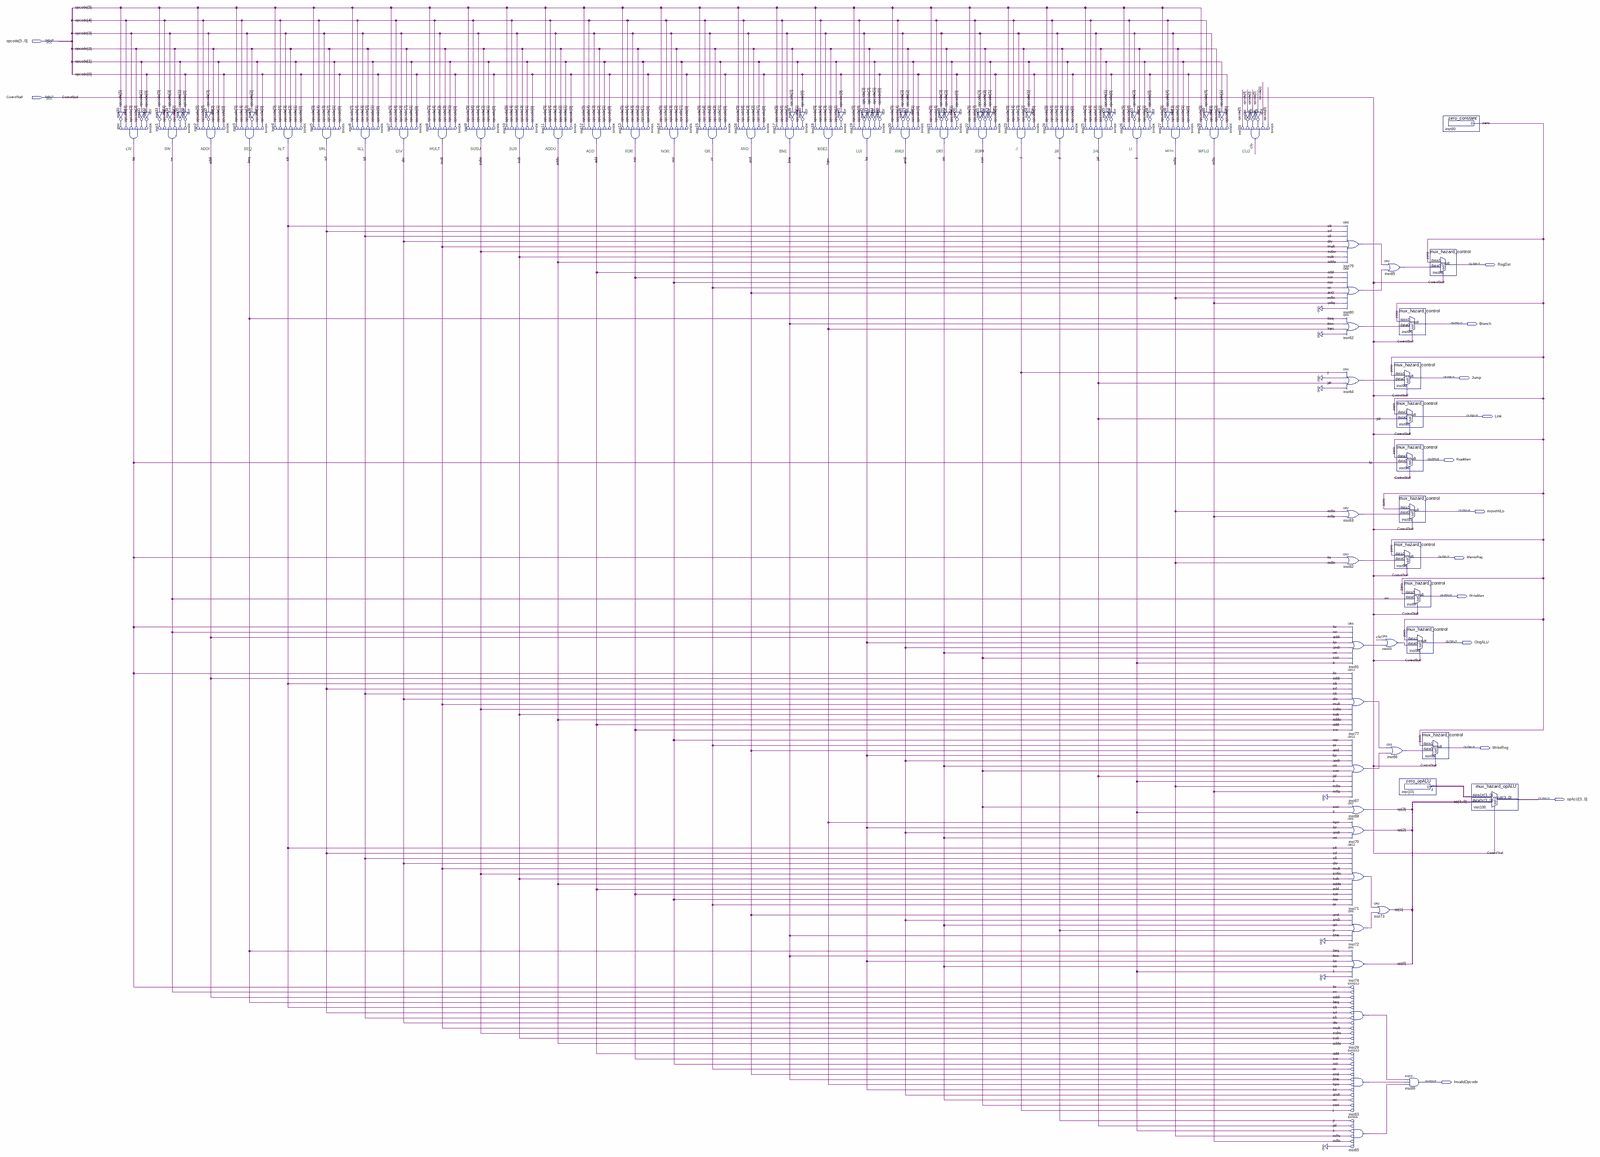
[diagram p0: schematic sheet, whole]
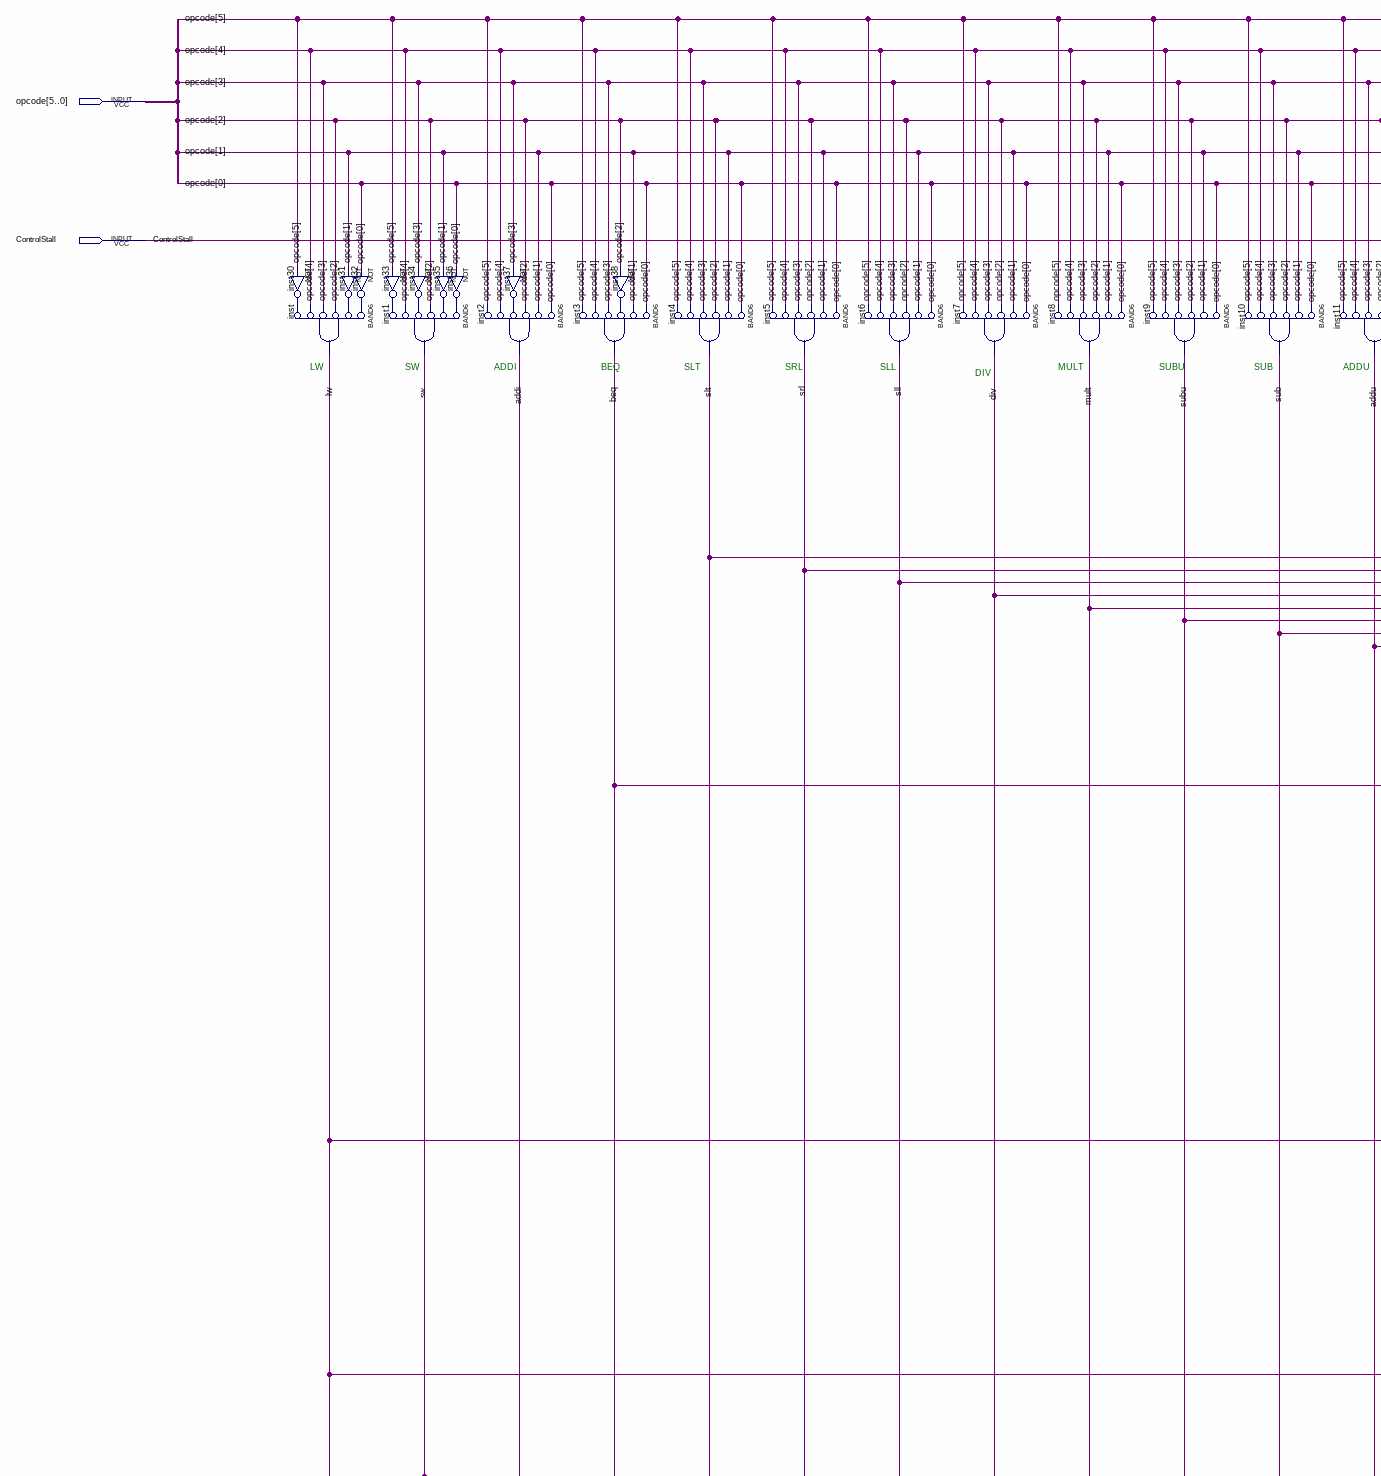
[diagram p1: schematic sheet, upper left part]
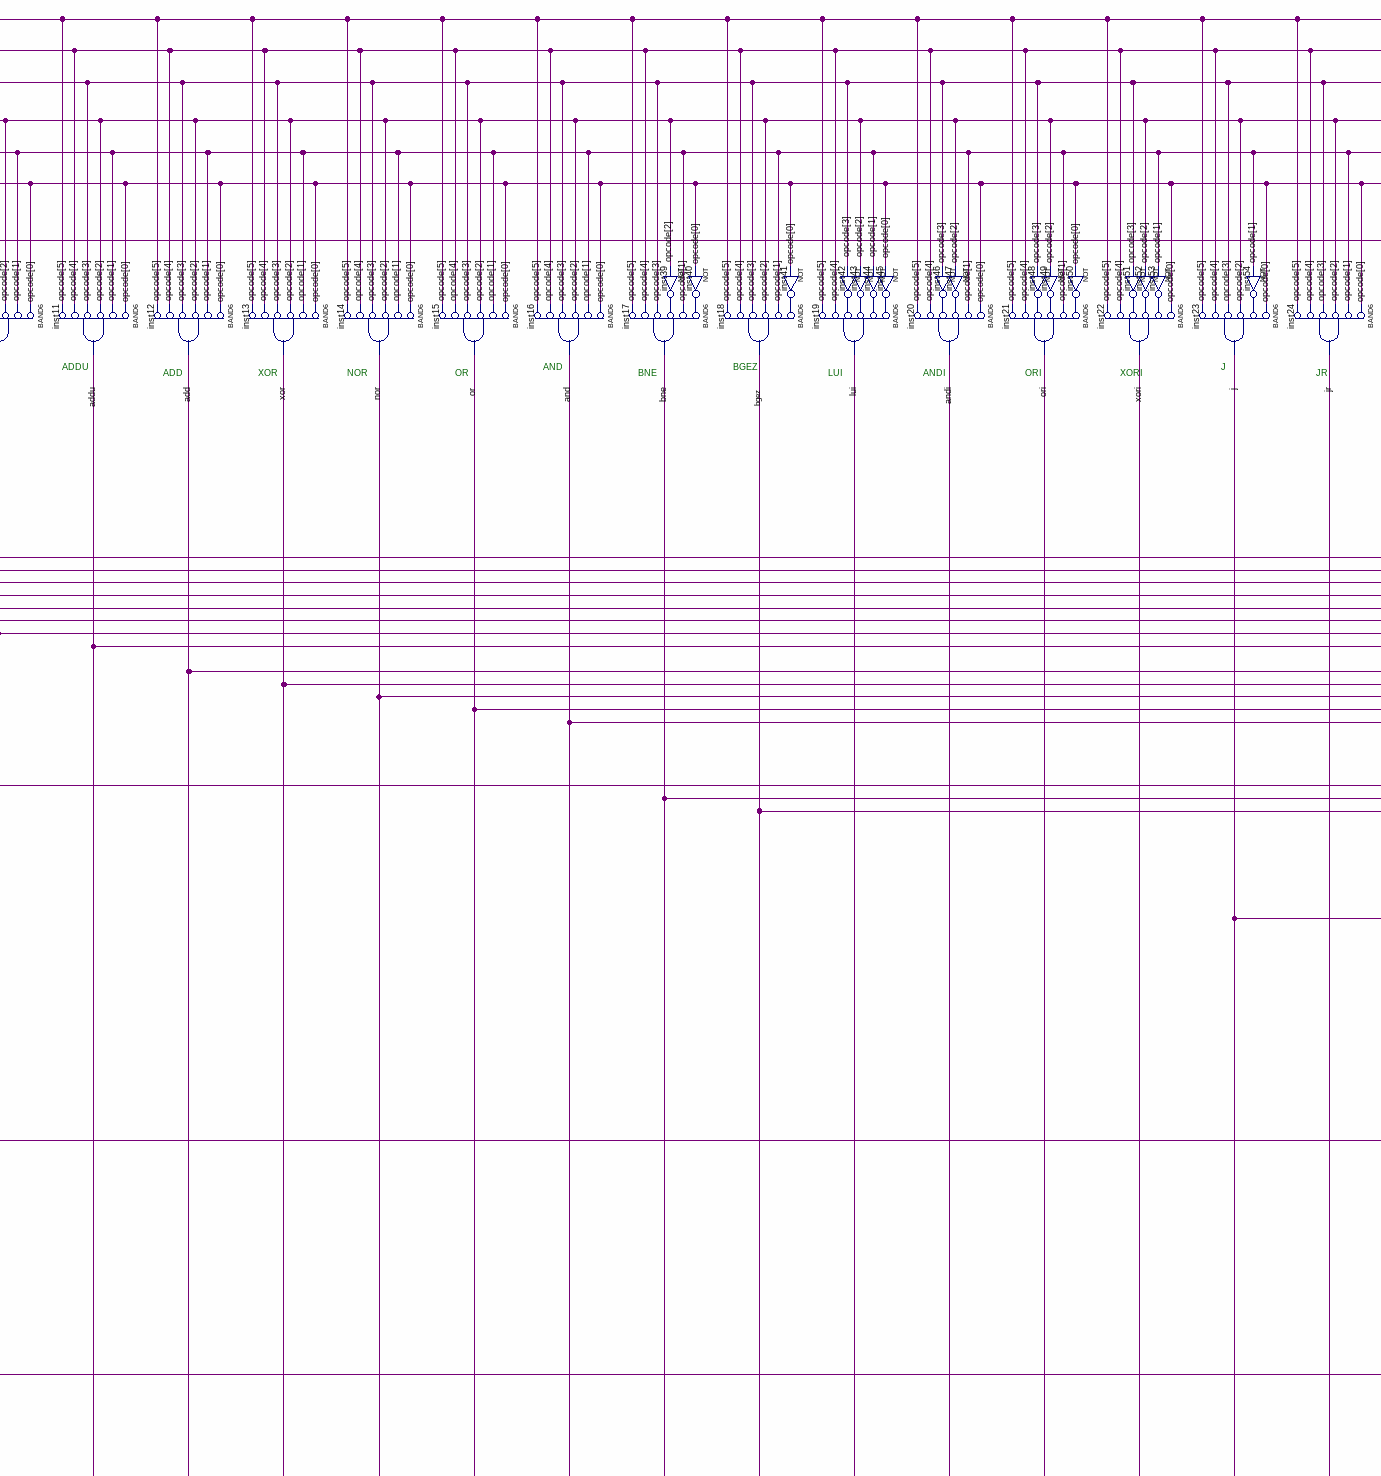
[diagram p2: schematic sheet, upper centre part]
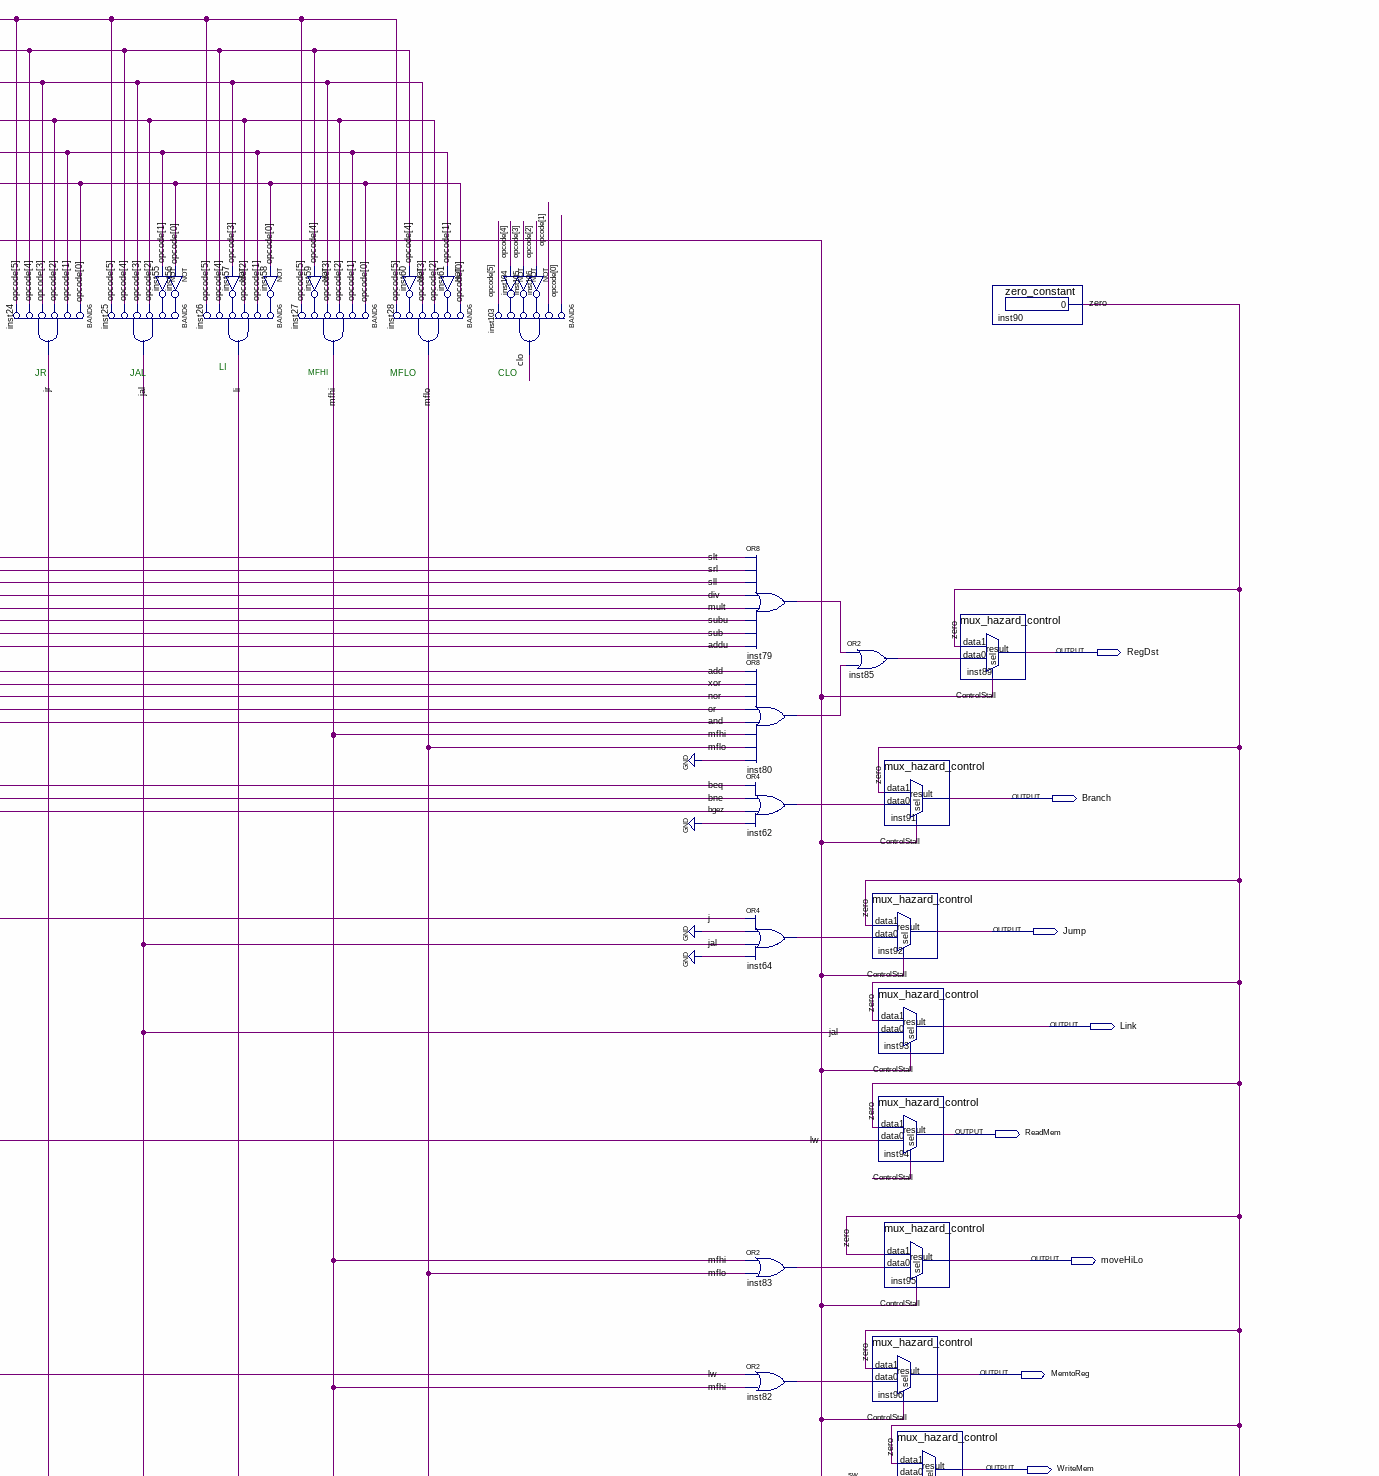
[diagram p3: schematic sheet, upper right part]
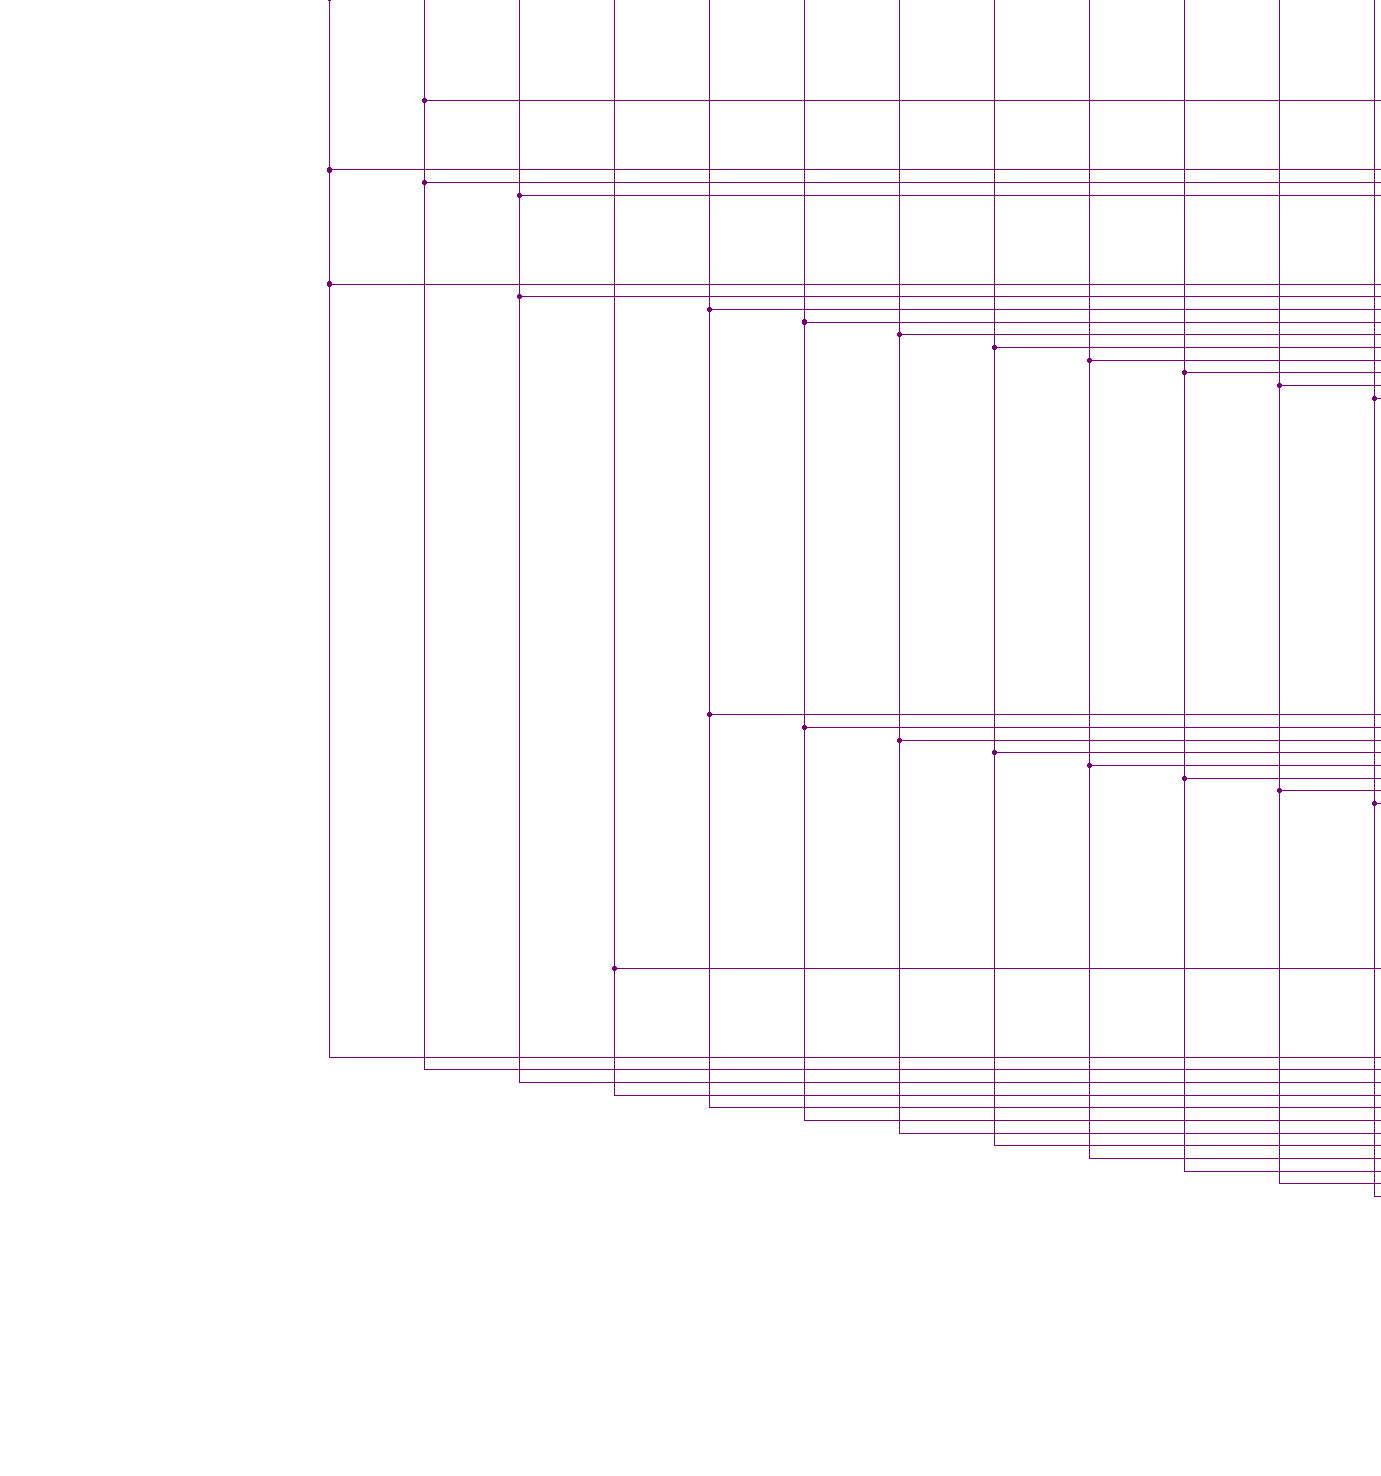
[diagram p4: schematic sheet, lower left part]
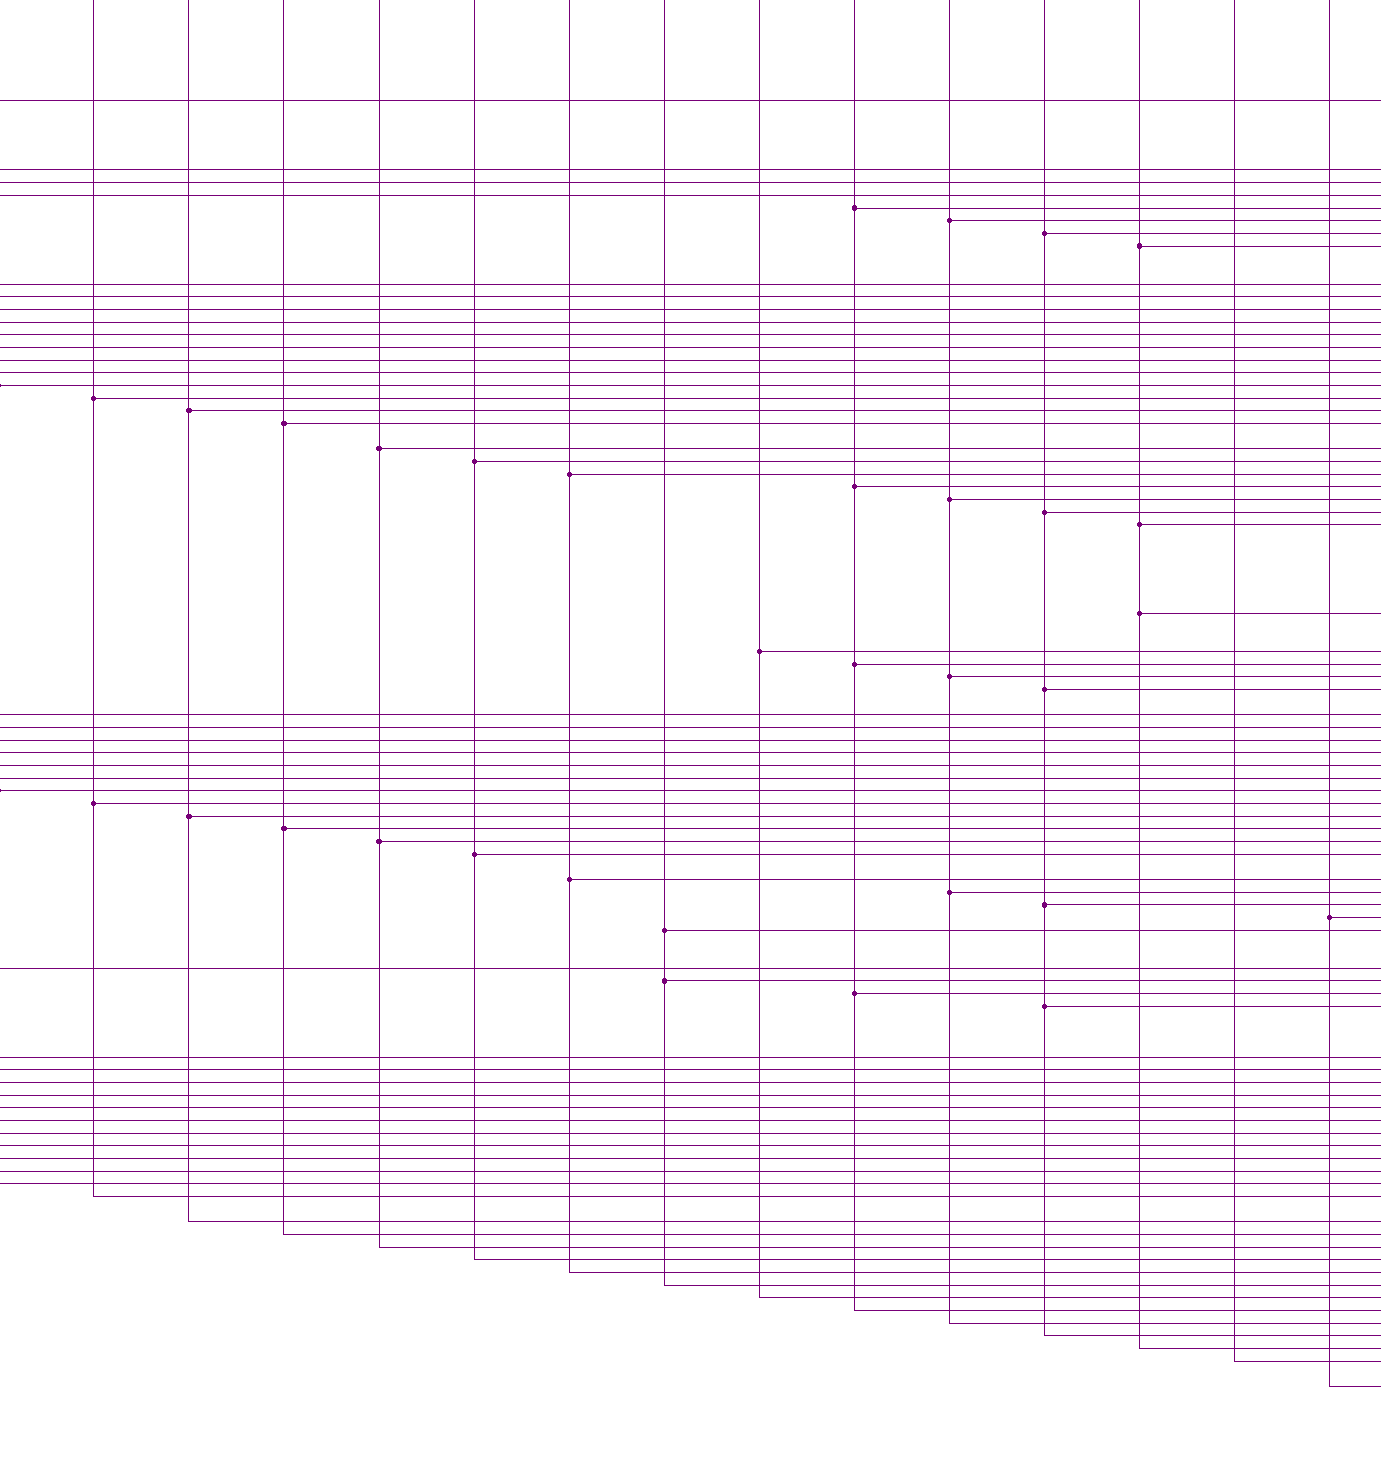
[diagram p5: schematic sheet, lower centre part]
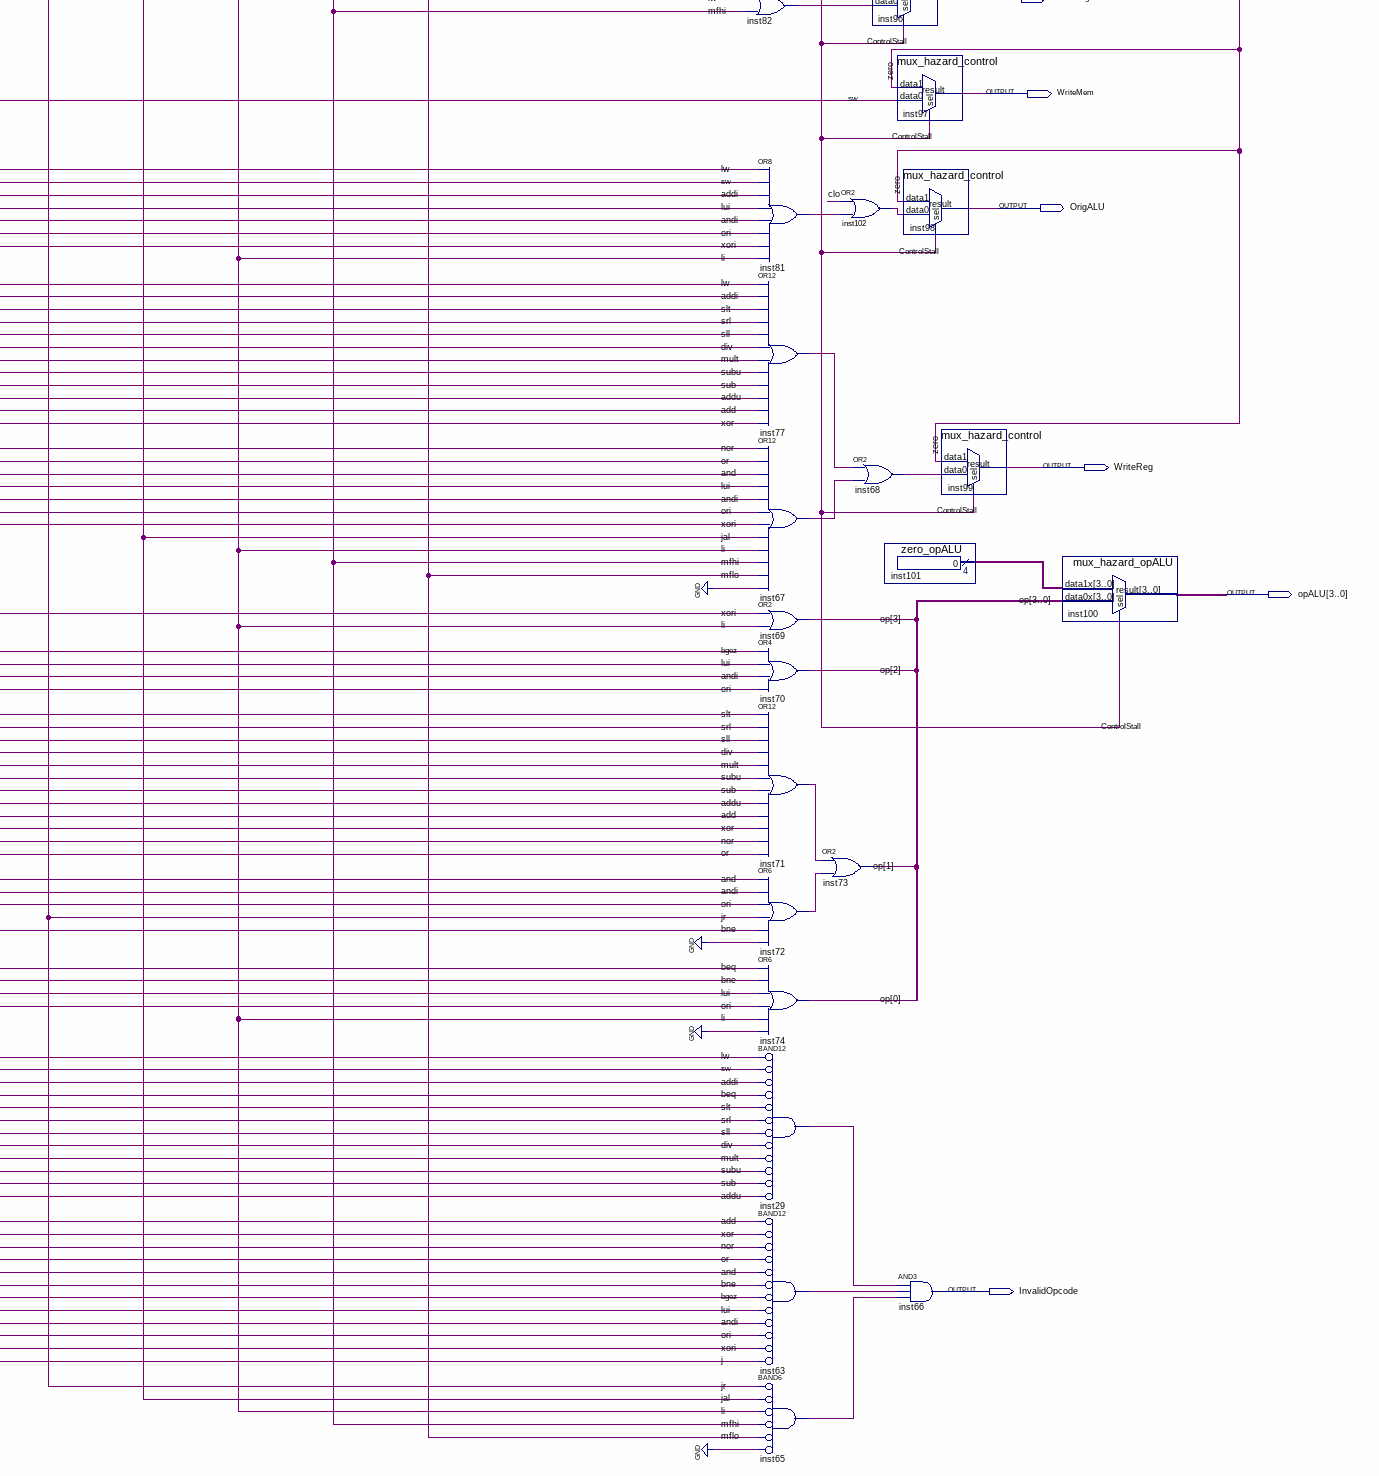
[diagram p6: schematic sheet, lower right part]
// Quartus schematic control.bdf as structural Verilog: 100 symbols, 14 pins
module control (
  input  [5:0] opcode,
  input  ControlStall,
  output RegDst,
  output Branch,
  output Jump,
  output Link,
  output ReadMem,
  output moveHiLo,
  output MemtoReg,
  output WriteMem,
  output OrigALU,
  output WriteReg,
  output [3:0] opALU,
  output InvalidOpcode
);

  wire add, addi, addu, \and , andi, beq, bgez, bne, clo, div, inst29_out, inst30_out, inst31_out,
       inst32_out, inst33_out, inst34_out, inst35_out, inst36_out, inst37_out, inst38_out, inst39_out,
       inst40_out, inst41_out, inst42_out, inst43_out, inst44_out, inst45_out, inst46_out, inst47_out,
       inst48_out, inst49_out, inst50_out, inst51_out, inst52_out, inst53_out, inst54_out, inst55_out,
       inst56_out, inst57_out, inst58_out, inst59_out, inst60_out, inst61_out, inst62_out, inst63_out,
       inst64_out, inst65_out, inst67_out, inst68_out, inst71_out, inst72_out, inst77_out, inst79_out,
       inst80_out, inst81_out, inst82_out, inst83_out, inst85_out, inst102_out, inst104_out, inst105_out,
       inst106_out, j, jal, jr, li, lui, lw, mfhi, mflo, mult, \nor , \or , ori, sll, slt, srl, sub, subu,
       sw, \xor , xori, zero;
  wire [3:0] inst101_result, op;

  not inst30 (inst30_out, opcode[5]);
  and inst (lw, ~inst32_out, ~inst31_out, ~opcode[2], ~opcode[3], ~opcode[4], ~inst30_out);  // BAND6
  not inst31 (inst31_out, opcode[1]);
  not inst32 (inst32_out, opcode[0]);
  not inst33 (inst33_out, opcode[5]);
  and inst1 (sw, ~inst36_out, ~inst35_out, ~opcode[2], ~inst34_out, ~opcode[4], ~inst33_out);  // BAND6
  not inst34 (inst34_out, opcode[3]);
  not inst35 (inst35_out, opcode[1]);
  not inst36 (inst36_out, opcode[0]);
  not inst37 (inst37_out, opcode[3]);
  and inst2 (addi, ~opcode[0], ~opcode[1], ~opcode[2], ~inst37_out, ~opcode[4], ~opcode[5]);  // BAND6
  and inst3 (beq, ~opcode[0], ~opcode[1], ~inst38_out, ~opcode[3], ~opcode[4], ~opcode[5]);  // BAND6
  not inst38 (inst38_out, opcode[2]);
  and inst4 (slt, ~opcode[0], ~opcode[1], ~opcode[2], ~opcode[3], ~opcode[4], ~opcode[5]);  // BAND6
  and inst5 (srl, ~opcode[0], ~opcode[1], ~opcode[2], ~opcode[3], ~opcode[4], ~opcode[5]);  // BAND6
  and inst6 (sll, ~opcode[0], ~opcode[1], ~opcode[2], ~opcode[3], ~opcode[4], ~opcode[5]);  // BAND6
  and inst7 (div, ~opcode[0], ~opcode[1], ~opcode[2], ~opcode[3], ~opcode[4], ~opcode[5]);  // BAND6
  and inst8 (mult, ~opcode[0], ~opcode[1], ~opcode[2], ~opcode[3], ~opcode[4], ~opcode[5]);  // BAND6
  and inst9 (subu, ~opcode[0], ~opcode[1], ~opcode[2], ~opcode[3], ~opcode[4], ~opcode[5]);  // BAND6
  and inst10 (sub, ~opcode[0], ~opcode[1], ~opcode[2], ~opcode[3], ~opcode[4], ~opcode[5]);  // BAND6
  and inst11 (addu, ~opcode[0], ~opcode[1], ~opcode[2], ~opcode[3], ~opcode[4], ~opcode[5]);  // BAND6
  and inst12 (add, ~opcode[0], ~opcode[1], ~opcode[2], ~opcode[3], ~opcode[4], ~opcode[5]);  // BAND6
  and inst13 (\xor , ~opcode[0], ~opcode[1], ~opcode[2], ~opcode[3], ~opcode[4], ~opcode[5]);  // BAND6
  and inst14 (\nor , ~opcode[0], ~opcode[1], ~opcode[2], ~opcode[3], ~opcode[4], ~opcode[5]);  // BAND6
  and inst15 (\or , ~opcode[0], ~opcode[1], ~opcode[2], ~opcode[3], ~opcode[4], ~opcode[5]);  // BAND6
  and inst16 (\and , ~opcode[0], ~opcode[1], ~opcode[2], ~opcode[3], ~opcode[4], ~opcode[5]);  // BAND6
  and inst17 (bne, ~inst40_out, ~opcode[1], ~inst39_out, ~opcode[3], ~opcode[4], ~opcode[5]);  // BAND6
  not inst39 (inst39_out, opcode[2]);
  not inst40 (inst40_out, opcode[0]);
  and inst18 (bgez, ~inst41_out, ~opcode[1], ~opcode[2], ~opcode[3], ~opcode[4], ~opcode[5]);  // BAND6
  not inst41 (inst41_out, opcode[0]);
  not inst42 (inst42_out, opcode[3]);
  and inst19 (lui, ~inst45_out, ~inst44_out, ~inst43_out, ~inst42_out, ~opcode[4], ~opcode[5]);  // BAND6
  not inst43 (inst43_out, opcode[2]);
  not inst44 (inst44_out, opcode[1]);
  not inst45 (inst45_out, opcode[0]);
  not inst46 (inst46_out, opcode[3]);
  not inst47 (inst47_out, opcode[2]);
  and inst20 (andi, ~opcode[0], ~opcode[1], ~inst47_out, ~inst46_out, ~opcode[4], ~opcode[5]);  // BAND6
  not inst48 (inst48_out, opcode[3]);
  not inst49 (inst49_out, opcode[2]);
  and inst21 (ori, ~inst50_out, ~opcode[1], ~inst49_out, ~inst48_out, ~opcode[4], ~opcode[5]);  // BAND6
  not inst50 (inst50_out, opcode[0]);
  and inst22 (xori, ~opcode[0], ~inst53_out, ~inst52_out, ~inst51_out, ~opcode[4], ~opcode[5]);  // BAND6
  not inst51 (inst51_out, opcode[3]);
  not inst52 (inst52_out, opcode[2]);
  not inst53 (inst53_out, opcode[1]);
  and inst23 (j, ~opcode[0], ~inst54_out, ~opcode[2], ~opcode[3], ~opcode[4], ~opcode[5]);  // BAND6
  not inst54 (inst54_out, opcode[1]);
  and inst24 (jr, ~opcode[0], ~opcode[1], ~opcode[2], ~opcode[3], ~opcode[4], ~opcode[5]);  // BAND6
  and inst25 (jal, ~inst56_out, ~inst55_out, ~opcode[2], ~opcode[3], ~opcode[4], ~opcode[5]);  // BAND6
  not inst55 (inst55_out, opcode[1]);
  not inst56 (inst56_out, opcode[0]);
  not inst57 (inst57_out, opcode[3]);
  and inst26 (li, ~inst58_out, ~opcode[1], ~opcode[2], ~inst57_out, ~opcode[4], ~opcode[5]);  // BAND6
  not inst58 (inst58_out, opcode[0]);
  not inst59 (inst59_out, opcode[4]);
  and inst27 (mfhi, ~opcode[0], ~opcode[1], ~opcode[2], ~opcode[3], ~inst59_out, ~opcode[5]);  // BAND6
  not inst60 (inst60_out, opcode[4]);
  and inst28 (mflo, ~opcode[0], ~inst61_out, ~opcode[2], ~opcode[3], ~inst60_out, ~opcode[5]);  // BAND6
  not inst61 (inst61_out, opcode[1]);
  not inst104 (inst104_out, opcode[4]);
  not inst105 (inst105_out, opcode[3]);
  not inst106 (inst106_out, opcode[2]);
  and inst103 (clo, ~opcode[0], ~opcode[1], ~inst106_out, ~inst105_out, ~inst104_out, ~opcode[5]);  // BAND6
  or inst79 (inst79_out, slt, srl, sll, div, mult, subu, sub, addu);
  or inst80 (inst80_out, add, \xor , \nor , \or , \and , mfhi, mflo, 1'b0);
  or inst62 (inst62_out, beq, bne, bgez, 1'b0);
  or inst64 (inst64_out, j, 1'b0, jal, 1'b0);
  or inst83 (inst83_out, mfhi, mflo);
  or inst82 (inst82_out, lw, mfhi);
  or inst81 (inst81_out, lw, sw, addi, lui, andi, ori, xori, li);
  or inst77 (inst77_out, lw, addi, slt, srl, sll, div, mult, subu, sub, addu, add, \xor );
  or inst67 (inst67_out, \nor , \or , \and , lui, andi, ori, xori, jal, li, mfhi, mflo, 1'b0);
  or inst69 (op[3], xori, li);
  or inst70 (op[2], bgez, lui, andi, ori);
  or inst71 (inst71_out, slt, srl, sll, div, mult, subu, sub, addu, add, \xor , \nor , \or );
  or inst72 (inst72_out, \and , andi, ori, jr, bne, 1'b0);
  or inst74 (op[0], beq, bne, lui, ori, li, 1'b0);
  and inst29 (inst29_out, ~lw, ~sw, ~addi, ~beq, ~slt, ~srl, ~sll, ~div, ~mult, ~subu, ~sub, ~addu);  // BAND12
  and inst63 (inst63_out, ~add, ~\xor , ~\nor , ~\or , ~\and , ~bne, ~bgez, ~lui, ~andi, ~ori, ~xori, ~j);  // BAND12
  and inst65 (inst65_out, ~jr, ~jal, ~li, ~mfhi, ~mflo, ~1'b0);  // BAND6
  or inst73 (op[1], inst71_out, inst72_out);
  or inst85 (inst85_out, inst79_out, inst80_out);
  mux_hazard_control inst92 (.data1(zero), .data0(inst64_out), .sel(ControlStall), .result(Jump));
  mux_hazard_control inst93 (.data1(zero), .data0(jal), .sel(ControlStall), .result(Link));
  mux_hazard_control inst94 (.data1(zero), .data0(lw), .sel(ControlStall), .result(ReadMem));
  mux_hazard_control inst96 (.data1(zero), .data0(inst82_out), .sel(ControlStall), .result(MemtoReg));
  or inst102 (inst102_out, clo, inst81_out);
  or inst68 (inst68_out, inst77_out, inst67_out);
  mux_hazard_control inst91 (.data1(zero), .data0(inst62_out), .sel(ControlStall), .result(Branch));
  mux_hazard_control inst95 (.data1(zero), .data0(inst83_out), .sel(ControlStall), .result(moveHiLo));
  mux_hazard_control inst97 (.data1(zero), .data0(sw), .sel(ControlStall), .result(WriteMem));
  mux_hazard_control inst98 (.data1(zero), .data0(inst102_out), .sel(ControlStall), .result(OrigALU));
  zero_opALU inst101 (.result(inst101_result));
  and inst66 (InvalidOpcode, inst29_out, inst63_out, inst65_out);
  mux_hazard_control inst89 (.data1(zero), .data0(inst85_out), .sel(ControlStall), .result(RegDst));
  mux_hazard_control inst99 (.data1(zero), .data0(inst68_out), .sel(ControlStall), .result(WriteReg));
  zero_constant inst90 (.result(zero));
  mux_hazard_opALU inst100 (.data1x(inst101_result), .data0x(op), .sel(ControlStall), .result(opALU));

  // Notes on the sheet:
  //   LW
  //   SW
  //   ADDI
  //   BEQ
  //   SLT
  //   SRL
  //   SLL
  //   MULT
  //   SUBU
  //   SUB
  //   ADDU
  //   AND
  //   BGEZ
  //   J
  //   LI
  //   DIV
  //   ADD
  //   XOR
  //   NOR
  //   OR
  //   BNE
  //   LUI
  //   ANDI
  //   ORI
  //   XORI
  //   JR
  //   JAL
  //   MFHI
  //   MFLO
  //   CLO
endmodule
